# EAGLE design Adafruit 2.8 inch TFT w Capacitive Touch rev D (EAGLE 9.6.2)
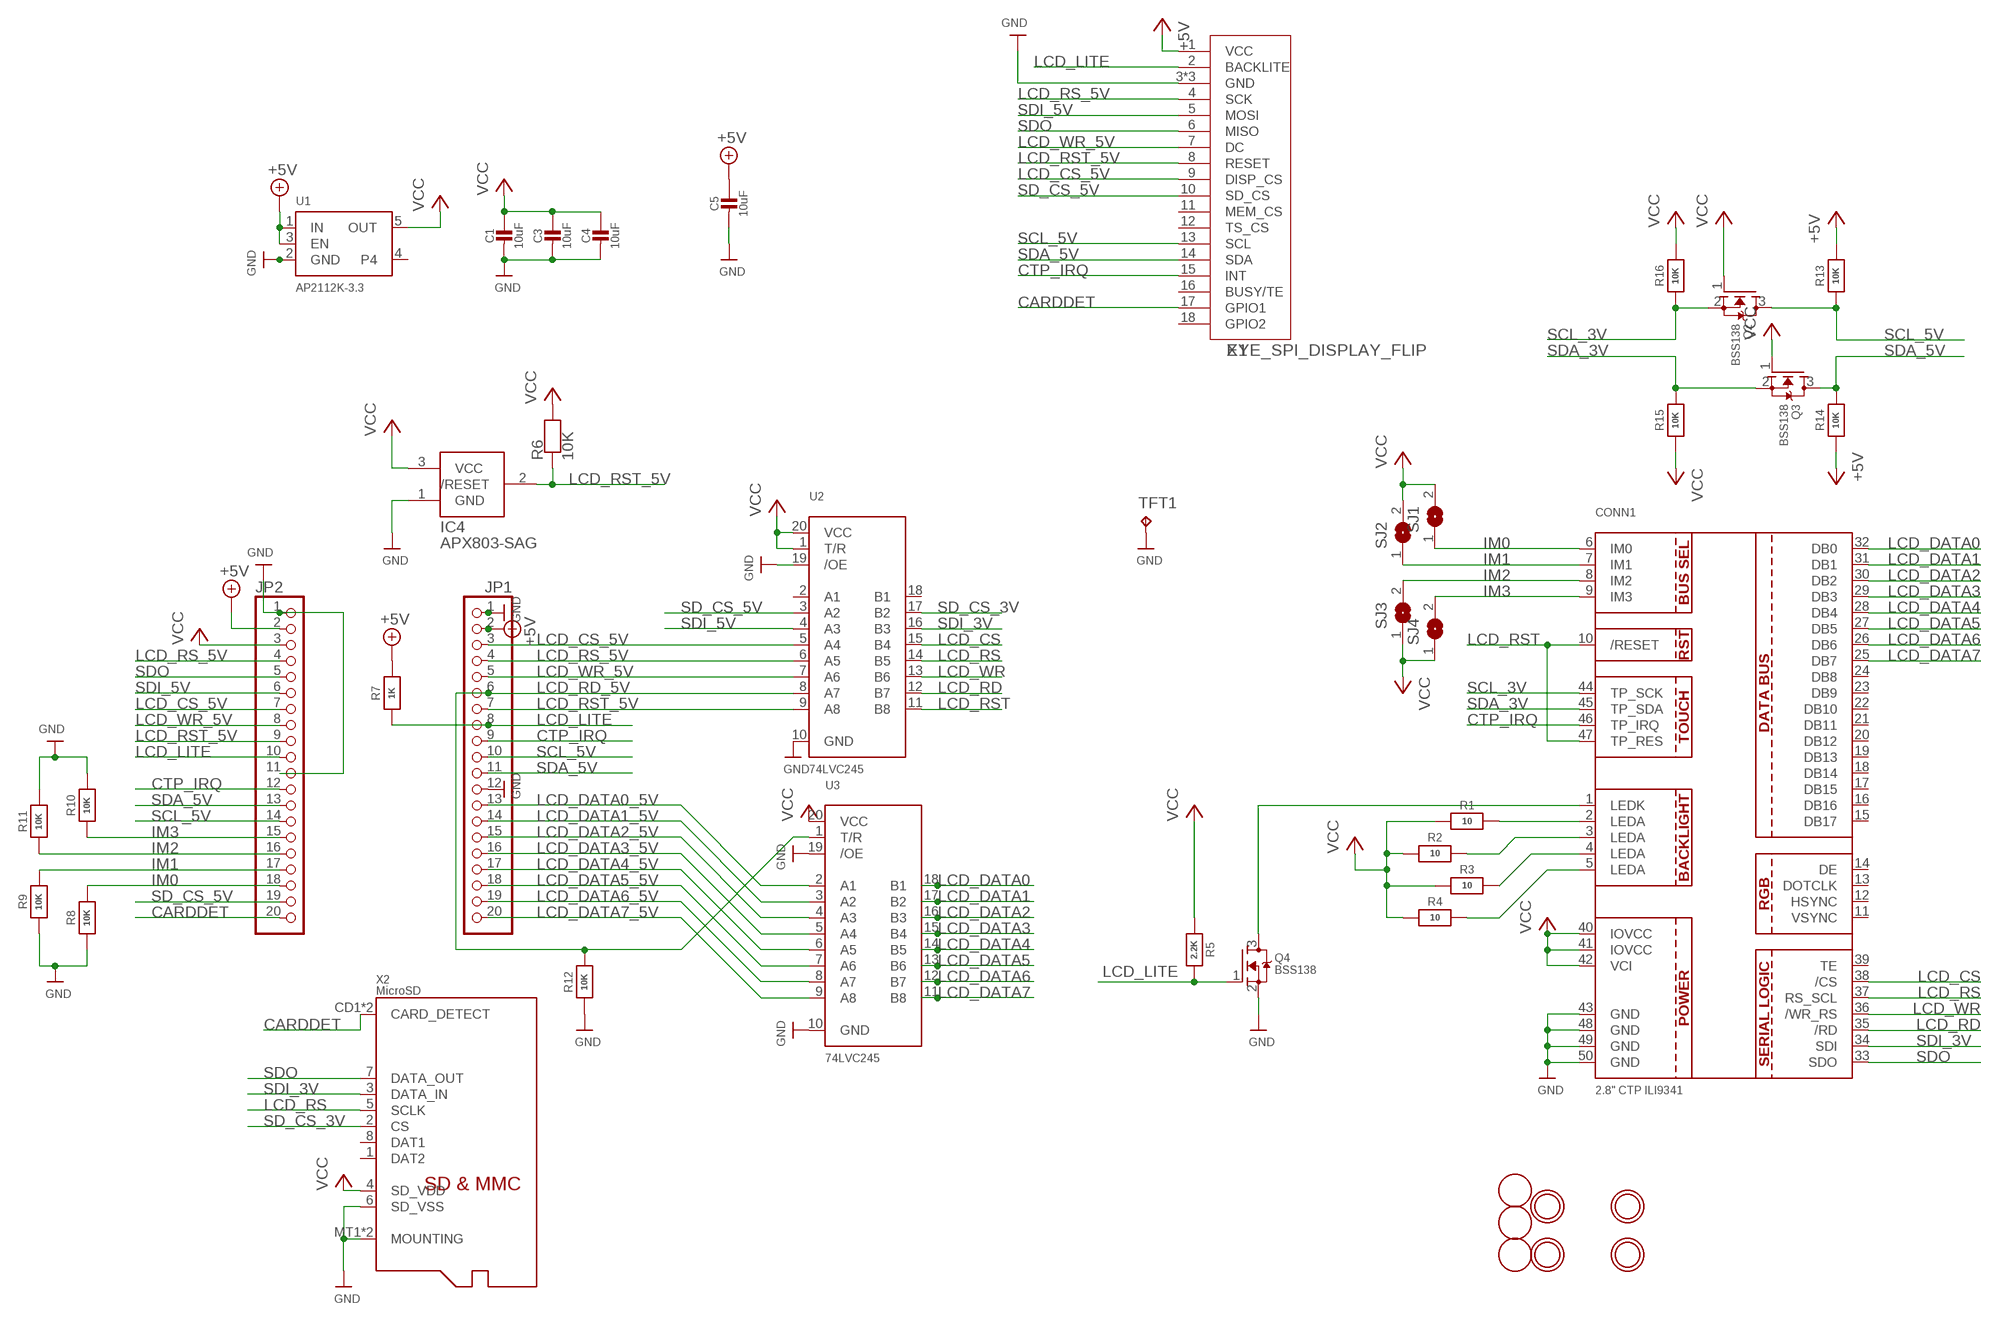
[diagram p0: schematic, sheet 1]

## Parts
C1  10uF  CAP_CERAMIC0805-NOOUTLINE  [0805-NO]
C3  10uF  CAP_CERAMIC0805-NOOUTLINE  [0805-NO]
C4  10uF  CAP_CERAMIC0805-NOOUTLINE  [0805-NO]
C5  10uF  CAP_CERAMIC0805-NOOUTLINE  [0805-NO]
CONN1  2.8" CTP ILI9341  DISP_LCD_CTP28_SAMPLE  [TFT_2.83IN_240X320_50PIN]
IC4  APX803-SAG  APX083-SAG  [SOT23-WIDE]
JP1  HEADER-1X20ROUND  [1X20_ROUND]
JP2  HEADER-1X20ROUND  [1X20_ROUND]
Q2  BSS138  MOSFET-NWIDE  [SOT23-WIDE]
Q3  BSS138  MOSFET-NWIDE  [SOT23-WIDE]
Q4  BSS138  MOSFET-NWIDE  [SOT23-WIDE]
R1  10  RESISTOR_0603_NOOUT  [0603-NO]
R2  10  RESISTOR_0603_NOOUT  [0603-NO]
R3  10  RESISTOR_0603_NOOUT  [0603-NO]
R4  10  RESISTOR_0603_NOOUT  [0603-NO]
R5  2.2K  RESISTOR_0603_NOOUT  [0603-NO]
R6  10K  RESISTOR_0603_NOOUT  [0603-NO]
R7  1K  RESISTOR_0603_NOOUT  [0603-NO]
R8  10K  RESISTOR_0603_NOOUT  [0603-NO]
R9  10K  RESISTOR_0603_NOOUT  [0603-NO]
R10  10K  RESISTOR_0603_NOOUT  [0603-NO]
R11  10K  RESISTOR_0603_NOOUT  [0603-NO]
R12  10K  RESISTOR_0603_NOOUT  [0603-NO]
R13  10K  RESISTOR_0603_NOOUT  [0603-NO]
R14  10K  RESISTOR_0603_NOOUT  [0603-NO]
R15  10K  RESISTOR_0603_NOOUT  [0603-NO]
R16  10K  RESISTOR_0603_NOOUT  [0603-NO]
SJ1  SOLDERJUMPER  [SOLDERJUMPER_ARROW_NOPASTE]
SJ2  SOLDERJUMPER  [SOLDERJUMPER_ARROW_NOPASTE]
SJ3  SOLDERJUMPER  [SOLDERJUMPER_ARROW_NOPASTE]
SJ4  SOLDERJUMPER  [SOLDERJUMPER_ARROW_NOPASTE]
TFT1  2.8in CTP TFT  TPTP06R  [TP06R]
U1  AP2112K-3.3  VREG_SOT23-5  [SOT23-5]
U2  74LVC245  74LCX245_TSSOP20  [TSSOP20]
U3  74LVC245  74LCX245_TSSOP20  [TSSOP20]
U$7  MOUNTINGHOLE3.0THIN  [MOUNTINGHOLE_3.0_PLATEDTHIN]
U$9  FIDUCIAL  [FIDUCIAL_1MM]
U$11  FIDUCIAL  [FIDUCIAL_1MM]
U$15  MOUNTINGHOLE3.0THIN  [MOUNTINGHOLE_3.0_PLATEDTHIN]
U$16  MOUNTINGHOLE3.0THIN  [MOUNTINGHOLE_3.0_PLATEDTHIN]
U$17  MOUNTINGHOLE3.0THIN  [MOUNTINGHOLE_3.0_PLATEDTHIN]
U$23  FIDUCIAL  [FIDUCIAL_1MM]
X1  EYE_SPI_DISPLAY_FLIP  [EYE_SPI_DISPLAY_BOTCONTACT]
X2  MicroSD  MICROSD  [MICROSD]

## Nets
+5V: C5.1 JP1.2 JP2.2 R7.2 R13.2 R14.1 U1.1(IN) U1.3(EN) X1.1(VCC)
CARDDET: JP2.20 X1.17(GPIO1) X2.CD1(CARD_DETECT) X2.CD2(CARD_DETECT)
CTP_IRQ: CONN1.46(TP_IRQ) JP1.9 JP2.12 X1.15(INT)
GND: C1.2 C3.2 C4.2 C5.2 CONN1.43(GND) CONN1.48(GND) CONN1.49(GND) CONN1.50(GND) IC4.1(GND) JP1.1 JP1.12 JP2.1 JP2.11 Q4.2(S) R8.1 R9.1 R10.2 R11.2 R12.1 TFT1.TP U1.2(GND) U2.10(GND) U2.19(/OE) U3.10(GND) U3.19(/OE) X1.3(GND) X1.SUPPORT1(GND) X1.SUPPORT2(GND) X2.6(SD_VSS) X2.MT1(MOUNTING) X2.MT2(MOUNTING)
IM0: CONN1.6(IM0) JP2.18 R8.2 SJ1.1
IM1: CONN1.7(IM1) JP2.17 R9.2 SJ2.1
IM2: CONN1.8(IM2) JP2.16 R11.1 SJ3.2
IM3: CONN1.9(IM3) JP2.15 R10.1 SJ4.2
LCD_CS: CONN1.38(/CS) U2.15(B4)
LCD_CS_5V: JP1.3 JP2.7 U2.5(A4) X1.9(DISP_CS)
LCD_DATA0: CONN1.32(DB0) U3.18(B1)
LCD_DATA0_5V: JP1.13 U3.2(A1)
LCD_DATA1: CONN1.31(DB1) U3.17(B2)
LCD_DATA1_5V: JP1.14 U3.3(A2)
LCD_DATA2: CONN1.30(DB2) U3.16(B3)
LCD_DATA2_5V: JP1.15 U3.4(A3)
LCD_DATA3: CONN1.29(DB3) U3.15(B4)
LCD_DATA3_5V: JP1.16 U3.5(A4)
LCD_DATA4: CONN1.28(DB4) U3.14(B5)
LCD_DATA4_5V: JP1.17 U3.6(A5)
LCD_DATA5: CONN1.27(DB5) U3.13(B6)
LCD_DATA5_5V: JP1.18 U3.7(A6)
LCD_DATA6: CONN1.26(DB6) U3.12(B7)
LCD_DATA6_5V: JP1.19 U3.8(A7)
LCD_DATA7: CONN1.25(DB7) U3.11(B8)
LCD_DATA7_5V: JP1.20 U3.9(A8)
LCD_LITE: JP1.8 JP2.10 Q4.1(G) R5.2 R7.1 X1.2(BACKLITE)
LCD_RD: CONN1.35(/RD) U2.12(B7)
LCD_RD_5V: JP1.6 R12.2 U2.8(A7) U3.1(T/R)
LCD_RS: CONN1.37(RS_SCL) U2.14(B5) X2.5(SCLK)
LCD_RS_5V: JP1.4 JP2.4 U2.6(A5) X1.4(SCK)
LCD_RST: CONN1.10(/RESET) CONN1.47(TP_RES) U2.11(B8)
LCD_RST_5V: IC4.2(/RESET) JP1.7 JP2.9 R6.1 U2.9(A8) X1.8(RESET)
LCD_WR: CONN1.36(/WR_RS) U2.13(B6)
LCD_WR_5V: JP1.5 JP2.8 U2.7(A6) X1.7(DC)
N$1: CONN1.5(LEDA) R4.2
N$2: CONN1.2(LEDA) R1.2
N$3: CONN1.3(LEDA) R2.2
N$4: CONN1.4(LEDA) R3.2
N$5: CONN1.1(LEDK) Q4.3(D)
SCL_3V: CONN1.44(TP_SCK) Q2.2(S) R16.1
SCL_5V: JP1.10 JP2.14 Q2.3(D) R13.1 X1.13(SCL)
SD_CS_3V: U2.17(B2) X2.2(CS)
SD_CS_5V: JP2.19 U2.3(A2) X1.10(SD_CS)
SDA_3V: CONN1.45(TP_SDA) Q3.2(S) R15.2
SDA_5V: JP1.11 JP2.13 Q3.3(D) R14.2 X1.14(SDA)
SDI_3V: CONN1.34(SDI) U2.16(B3) X2.3(DATA_IN)
SDI_5V: JP2.6 U2.4(A3) X1.5(MOSI)
SDO: CONN1.33(SDO) JP2.5 X1.6(MISO) X2.7(DATA_OUT)
VCC: C1.1 C3.1 C4.1 CONN1.40(IOVCC) CONN1.41(IOVCC) CONN1.42(VCI) IC4.3(VCC) JP2.3 Q2.1(G) Q3.1(G) R1.1 R2.1 R3.1 R4.1 R5.1 R6.2 R15.1 R16.2 SJ1.2 SJ2.2 SJ3.1 SJ4.1 U1.5(OUT) U2.1(T/R) U2.20(VCC) U3.20(VCC) X2.4(SD_VDD)
Unconnected: CONN1.11(VSYNC) CONN1.12(HSYNC) CONN1.13(DOTCLK) CONN1.14(DE) CONN1.15(DB17) CONN1.16(DB16) CONN1.17(DB15) CONN1.18(DB14) CONN1.19(DB13) CONN1.20(DB12) CONN1.21(DB11) CONN1.22(DB10) CONN1.23(DB9) CONN1.24(DB8) CONN1.39(TE) U1.4 U2.2(A1) U2.18(B1) X1.11(MEM_CS) X1.12(TS_CS) X1.16(BUSY/TE) X1.18(GPIO2) X2.1(DAT2) X2.8(DAT1)

## Library data of the parts
C1 C3-C5 = microbuilder:CAP_CERAMIC: Ceramic Capacitors For new designs, use the packages preceded by an '_' character since they are more reliable: The following footprints should be used on most boards: _0402 - Standard footprint for regular board layouts _0603 - Standard footprint for regular board layouts _0805 - Standard footprint for regular board layouts _1206 - Standard footprint for regular board layouts For extremely tight-pitch boards where space is at a premium, the following 'micro-pitch' footprints can be used (smaller pads, no silkscreen outline, etc.): _0402MP - Micro-pitch footprint for very dense/compact boards _0603MP - Micro-pitch footprint for very dense/compact boards _0805MP - Micro-pitch footprint for very dense/compact boards _1206MP - Micro-pitch footprint for very dense/compact boards
CONN1 = adafruit_display:DISP_LCD_CTP28: 2.83" 240x320 Pixel Capacitive Touch Display
IC4 = microbuilder:APX083
JP1 JP2 = microbuilder:HEADER-1X20
Q2-Q4 = microbuilder:MOSFET-N: N-Channel Mosfet LEGEND VDS: Voltage Drain-Source ID: Drain Current RDS(ON): Drain-Source On-State Resistance VGS(TH): Gate-Source Threshold Voltage CISS: Drain-Source Input Capacitance SOT-23 Name VDS ID RDS(ON) VGS(TH) CISS Order Number 2N7002E 60V 260mA 2.5 Ohm 2.5V @ 250uA 26.7pF @ 25V 2N7002ET1GOSTR-ND BSH103 30V 850mA 400 mOhm 400mV @ 1mA 83pF @ 24V BSH103,235-ND BSS138 60V 320mA 1.6 Ohm 1.5V @ 250uA 50pF @ 10V Mouser: 771-BSS138PW115 DMN2075U-7 20V 4.2A 38 mOhm 1V @ 250 uA 594.3pF @ 10V DMN2075U-7DICT-ND * BSS138 good choice for I2C level-shifting POWERPAK 1212-8 Name VDS ID RDS(ON) VGS(TH) CISS Order Number Si7308DN 60V 6A 58 mOhm 3V @ 250uA 665pF @ 15V SI7308DN-T1-E3CT-ND
R1-R16 = microbuilder:RESISTOR: Resistors For new designs, use the packages preceded by an '_' character since they are more reliable: The following footprints should be used on most boards: _0402 - Standard footprint for regular board layouts _0603 - Standard footprint for regular board layouts _0805 - Standard footprint for regular board layouts _1206 - Standard footprint for regular board layouts For extremely tight-pitch boards where space is at a premium, the following 'micro-pitch' footprints can be used (smaller pads, no silkscreen outline, etc.): _0402MP - Micro-pitch footprint for very dense/compact boards _0603MP - Micro-pitch footprint for very dense/compact boards _0805MP - Micro-pitch footprint for very dense/compact boards _1206MP - Micro-pitch footprint for very dense/compact boards
SJ1-SJ4 = microbuilder:SOLDERJUMPER: SMD Solder JUMPER Solder the two pads together to create a connection, or remove the solder to break it. REFLOW - Use this footprint for solder paste and reflow ovens. WAVE - Use this footprint for hand-soldering (larger pads). CLOSED - Has a trace between the two pads to ensure it is closed by default. The trace needs to be cut to disable the jumper, and can be closed again by creating a solder bridge between the two pads.; BOM: EXCLUDE
TFT1 = testpad:TP: Test pad
U1 = adafruit_power:VREG_SOT23-5: SOT23-5 Fixed Voltage Regulators Part Current Out V Out V In V Dropout θJA (°C/W) TJ (°C) Digikey Part No. ADP121 150mA 3.3V 3.4-5.5V 0.09V @ 150mA -- -- ADP121-AUJZ33R7CT-ND ADP121 150mA 3.0V 3.1-5.5V 0.09V @ 150mA -- -- ADP121-AUJZ30R7CT-ND ADP122 300mA 3.3V 3.4-5.5V 0.085V @ 300mA -- -- ADP122AUJZ-3.3-R7CT-ND ADP1712 300mA 3.3V 3.5-5.5V 0.17V @ 300mA -- -- ADP1712AUJZ-3.3-R7TR-ND AP7311 (Low Cost) 150mA 3.3V 3.5-6V 0.15V @ 150mA -- -- AP7311-33WG-7DICT-ND LD39015M18R 150mA 1.8V 1.9V-5.5V 0.08V @ 100mA -- -- 497-6977-1-ND LP2985A-33DBVR 150mA 3.3V 3.3-16V 0.28V @ 150mA 206 150 296-18479-1-ND MCP1824T-3302E/OT 300mA 3.3V 3.5V-6V 0.2V @ 300mA -- -- MCP1824T-3302E/OTCT-ND MIC5205-2.5YM5 TR 150mA 2.5V 2.7-16V 0.165V @ 150mA -- -- 576-1257-2-ND MIC5205-3.0YM5 TR 150mA 3.0V 3.2V-16V 0.165V @ 150mA -- -- 576-1258-2-ND MIC5205-3.3YM5 TR 150mA 3.3V 3.5V-16V 0.165V @ 150mA -- -- 576-1259-2-ND TPS780330220 150mA 3.3V+2.2V 3.6-5.5V 250mV Max -- -- 296-23332-1-ND TDA3663/N1,135 100mA 3.3V 3.5-45V 0.18V @ 50mA -- -- 568-5343-1-ND Max operating temp can be calculated using θJA, TJ (max junction temperature), and power in watts. Set the "Maximum Ambient Temperature" until it reaches TJ ("Max Junction Temperature"), which is the absolute limit for safe use of the regulator: Heat Sink Temperature Calculator <http://www.daycounter.com/Calculators/Heat-Sink-Temperature-Calculator.phtml> For example, With 12V source into a 3.3V LP2985 and a 30mA load, we are dissipating (12V-3.3V) * 0.03A = 0.261W. With a θJA of 206 °C/W, a TJ of 150°C, and 261mW we can safely use the chip without a heat sink up to 75°C (=147.1°C Junction Temperature).; JLC_ROTATION: 0
U2 U3 = microbuilder:74LCX245: 74LCX245MTC - 5.0V Tolerant Bi-Directional Buffer Can be used to interface 5.0V logic to 2.5 or 3.3V devices Digikey: 74LCX245MTCXTR-ND Mouser: 512-74LCX245MTCX
U$7 U$15-U$17 = adafruit_electromech:MOUNTINGHOLE: Mounting Hole For #2 screws (0.086"/2.18mm width, 0.094"/2.4mm hole) use 2.5mm; BOM: EXCLUDE
U$9 U$11 U$23 = adafruit:FIDUCIAL: For use by pick and place machines to calibrate the vision/machine, 1mm By microbuilder.eu
X1 = adafruit_display:EYE_SPI_DISPLAY; LCSC: C2856802
X2 = adafruit_electromech:MICROSD: MicroSD/Transflash Card Holder with SPI pinout 3M: 2908-05WB-MG 4UConnector: 19656 Footprint courtesy: Adafruit Industries; JLC_ROTATION: 90; LCSC: C125617

## Board
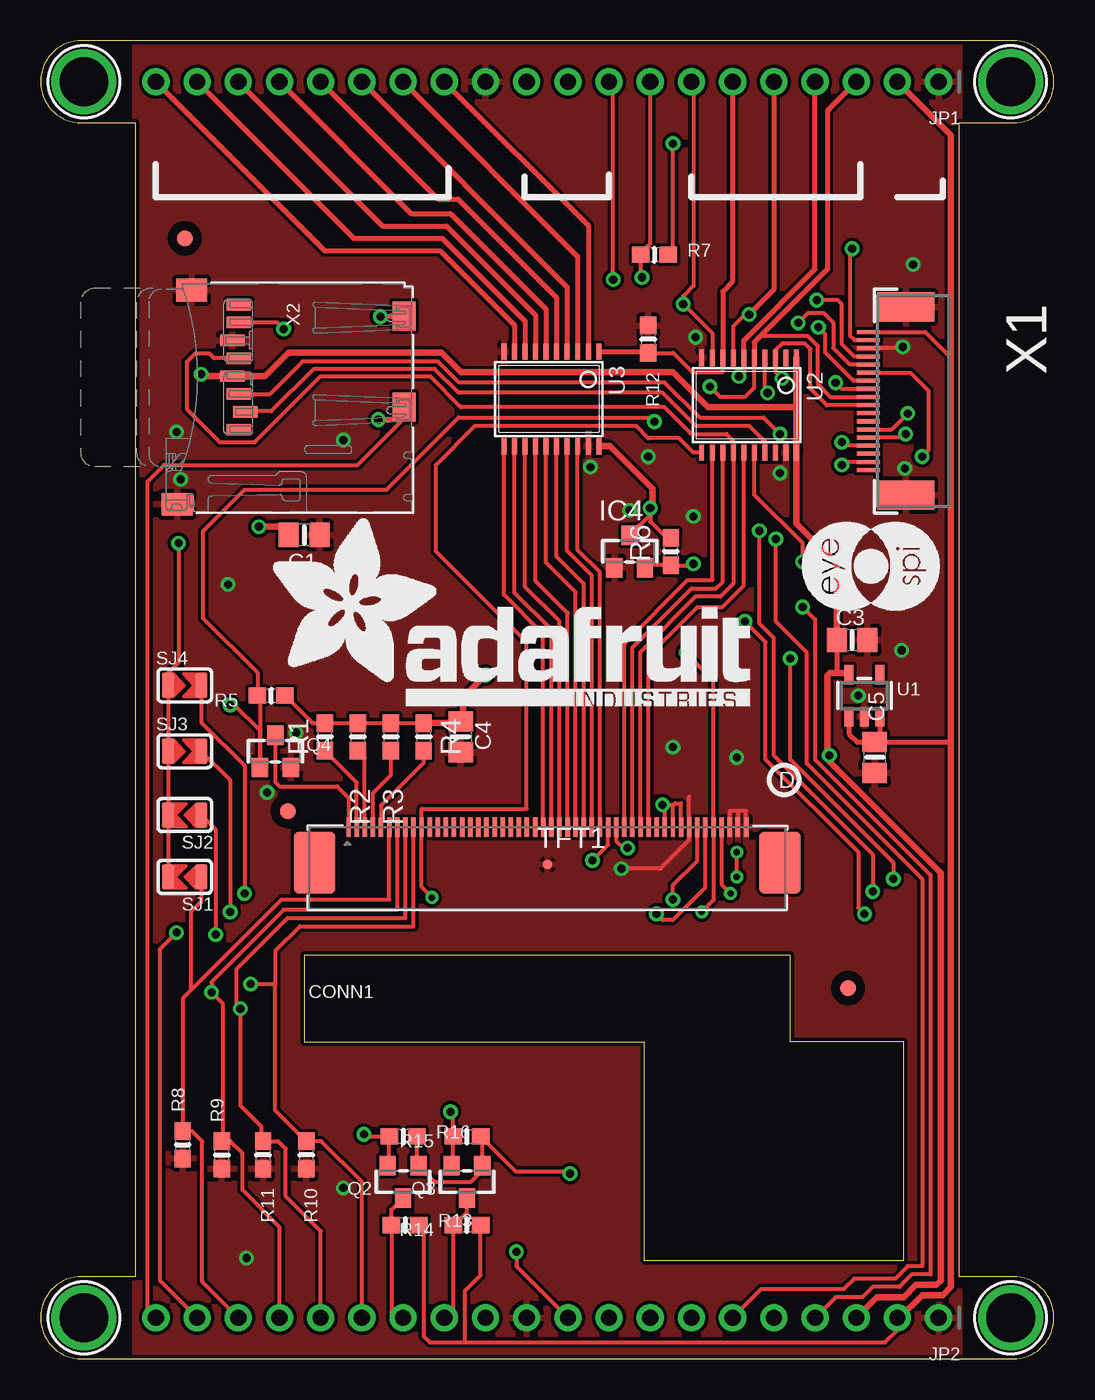
[diagram p1: board, top side]
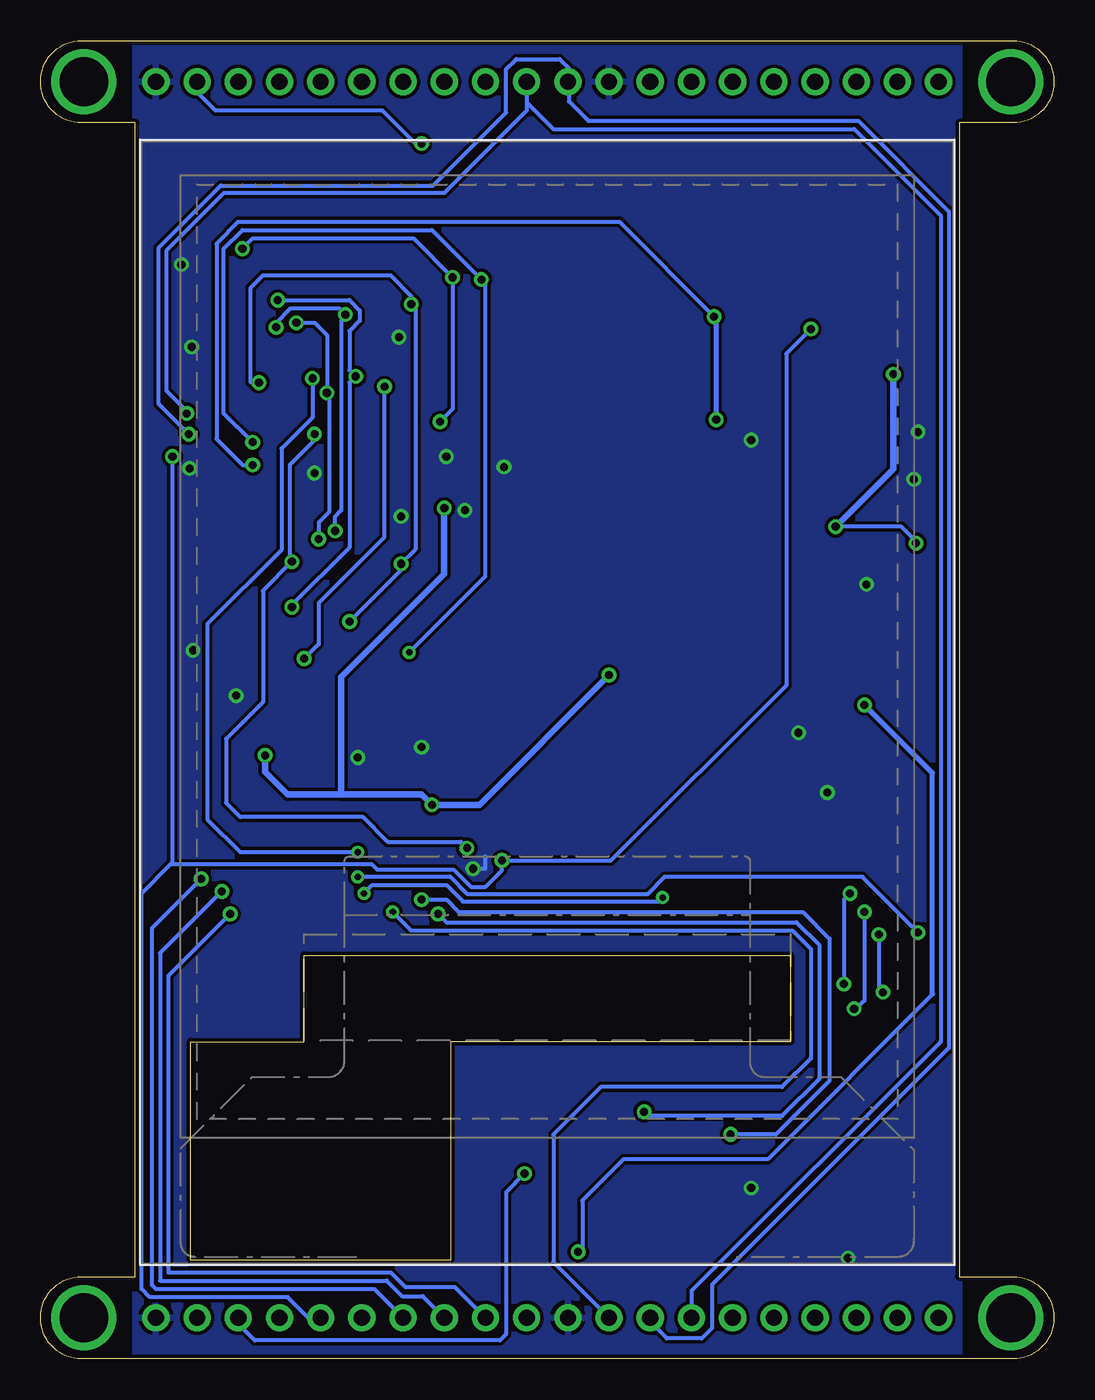
[diagram p2: board, bottom side, seen from below]

Size 62.48 x 81.28 mm. Coordinates in mm from the lower left corner, seen from the top.
Outline: 0,2.54 arc90 2.54,0 59.94,0 arc90 62.48,2.54 arc90 59.94,5.08 56.64,5.08 56.64,76.2 59.94,76.2 arc90 62.48,78.74 arc90 59.94,81.28 2.54,81.28 arc90 0,78.74 arc90 2.54,76.2 5.84,76.2 5.84,5.08 2.54,5.08 arc90 0,2.54
Outline: 16.26,24.89 16.26,19.56 37.21,19.56 37.21,6.1 53.21,6.1 53.21,19.56 46.23,19.56 46.23,24.89 16.26,24.89
Copper layers (1*16): Top 0.035mm / dielectric 1.5mm / Bottom 0.035mm
Design rules "adafruit *": minimum track width 8mil, minimum drill 15.5mil, track to track 8mil, track to pad 8mil, pad to pad 8mil, via to via 8mil, smd to smd 8mil, copper to edge 10mil, drill to drill 8mil, minimum pad ring 10mil, minimum via ring 8mil, stop-mask expansion 4mil, vias tented up to drill 20mil, thermal gap 10mil
tRestrict: area 42.7,32.6 to 42.8,32.9; area 43.2,32.6 to 43.3,32.9

### Footprints (pad centres in the part's own frame; a part is rotated, then mirrored left to right if it is on the bottom)
0805-NO = smd 1.24 x 1.5: 1 -0.95,0; 2 0.95,0
TFT_2.83IN_240X320_50PIN = smd 0.275 x 1.2 bottom: 1 12.25,1.04; 2 11.75,1.04; 3 11.25,1.04; 4 10.75,1.04; 5 10.25,1.04; 6 9.75,1.04; 7 9.25,1.04; 8 8.75,1.04; 9 8.25,1.04; 10 7.75,1.04; 11 7.25,1.04; 12 6.75,1.04; 13 6.25,1.04; 14 5.75,1.04; 15 5.25,1.04; 16 4.75,1.04; 17 4.25,1.04; 18 3.75,1.04; 19 3.25,1.04; 20 2.75,1.04; 21 2.25,1.04; 22 1.75,1.04; 23 1.25,1.04; 24 0.75,1.04; 25 0.25,1.04; 26 -0.25,1.04; 27 -0.75,1.04; 28 -1.25,1.04; 29 -1.75,1.04; 30 -2.25,1.04; 31 -2.75,1.04; 32 -3.25,1.04; 33 -3.75,1.04; 34 -4.25,1.04; 35 -4.75,1.04; 36 -5.25,1.04; 37 -5.75,1.04; 38 -6.25,1.04; 39 -6.75,1.04; 40 -7.25,1.04; 41 -7.75,1.04; 42 -8.25,1.04; 43 -8.75,1.04; 44 -9.25,1.04; 45 -9.75,1.04; 46 -10.25,1.04; 47 -10.75,1.04; 48 -11.25,1.04; 49 -11.75,1.04; 50 -12.25,1.04 | smd 2.54 x 3.81 bottom: PAD1 14.35,-1.152; PAD2 -14.35,-1.152
SOT23-WIDE = smd 1 x 1.2: 1 -0.95,-1; 2 0.95,-1; 3 0,1
1X20_ROUND = drill 1 pad 1.676: 1 -24.13,0; 2 -21.59,0; 3 -19.05,0; 4 -16.51,0; 5 -13.97,0; 6 -11.43,0; 7 -8.89,0; 8 -6.35,0; 9 -3.81,0; 10 -1.27,0; 11 1.27,0; 12 3.81,0; 13 6.35,0; 14 8.89,0; 15 11.43,0; 16 13.97,0; 17 16.51,0; 18 19.05,0; 19 21.59,0; 20 24.13,0
0603-NO = smd 1.075 x 1: 1 -0.85,0; 2 0.85,0
SOLDERJUMPER_ARROW_NOPASTE = smd 0.762 x 1.524: 1 -1.016,0; 2 1.016,0
TP06R = smd 0.6 x 0.6: TP 0,0
SOT23-5 = smd 0.55 x 1.2: 1 -0.95,-1.3; 2 0,-1.3; 3 0.95,-1.3; 4 0.95,1.3; 5 -0.95,1.3
TSSOP20 = smd 0.305 x 0.991: 1 -2.925,-2.918; 2 -2.275,-2.918; 3 -1.625,-2.918; 4 -0.975,-2.918; 5 -0.325,-2.918; 6 0.325,-2.918; 7 0.975,-2.918; 8 1.625,-2.918; 9 2.275,-2.918; 10 2.925,-2.918; 11 2.925,2.918; 12 2.275,2.918; 13 1.625,2.918; 14 0.975,2.918; 15 0.325,2.918; 16 -0.325,2.918; 17 -0.975,2.918; 18 -1.625,2.918; 19 -2.275,2.918; 20 -2.925,2.918
MOUNTINGHOLE_3.0_PLATEDTHIN = drill 3 pad 3.6: P$1 0,0
FIDUCIAL_1MM = smd 1 x 1: 1 0,0
EYE_SPI_DISPLAY_BOTCONTACT = smd 0.25 x 1.4: 1 4.25,1.154; 2 3.75,1.154; 3 3.25,1.154; 4 2.75,1.154; 5 2.25,1.154; 6 1.75,1.154; 7 1.25,1.154; 8 0.75,1.154; 9 0.25,1.154; 10 -0.25,1.154; 11 -0.75,1.154; 12 -1.25,1.154; 13 -1.75,1.154; 14 -2.25,1.154; 15 -2.75,1.154; 16 -3.25,1.154; 17 -3.75,1.154; 18 -4.25,1.154 | smd 1.8 x 3.5: SUPPORT1 -5.8,-1.152; SUPPORT2 5.8,-1.152
MICROSD = smd 0.7 x 1.5: 1 1.761,-3.147; 2 0.661,-2.747; 3 -0.439,-3.147; 4 -1.539,-3.547; 5 -2.639,-3.147; 6 -3.739,-3.547; 7 -4.839,-3.147; 8 -5.939,-3.147 | smd 1.8 x 1.4: CD1 -5.239,7.053; CD2 0.38,7.053 | smd 1.4 x 1.9: MT1 -6.839,-6.047; MT2 6.361,-6.947

### Placement (x,y rotation side)
C1  16.26,50.8 0 top
C3  50.04,44.32 0 top
C4  25.91,38.35 270 top
C5  51.44,37.08 270 top
CONN1  31.24,31.75 0 bottom
IC4  36.32,49.78 0 top
JP1  31.24,78.74 180 top
JP2  31.24,2.54 180 top
PLABEL0  [PLABEL0]  27.43,37.97 0 top
PLABEL1  [PLABEL1]  55.88,17.65 90 top
PLABEL2  [PLABEL2]  26.54,52.7 0 top
PLABEL3  [PLABEL3]  24.64,65.28 0 top
PLABEL4  [PLABEL4]  6.6,77.47 270 top
PLABEL5  [PLABEL5]  8.89,77.47 270 top
PLABEL6  [PLABEL6]  11.43,77.47 270 top
PLABEL7  [PLABEL7]  13.97,77.6 270 top
PLABEL8  [PLABEL8]  16.64,77.72 270 top
PLABEL9  [PLABEL9]  19.18,77.72 270 top
PLABEL10  [PLABEL10]  21.59,77.72 270 top
PLABEL11  [PLABEL11]  24.26,77.72 270 top
PLABEL12  [PLABEL12]  26.8,77.72 270 top
PLABEL13  [PLABEL13]  29.21,77.72 270 top
PLABEL14  [PLABEL14]  31.88,77.72 270 top
PLABEL15  [PLABEL15]  34.29,77.72 270 top
PLABEL16  [PLABEL16]  36.96,77.72 270 top
PLABEL17  [PLABEL17]  39.5,77.72 270 top
PLABEL18  [PLABEL18]  41.91,77.72 270 top
PLABEL19  [PLABEL19]  44.58,77.72 270 top
PLABEL20  [PLABEL20]  47.12,77.72 270 top
PLABEL21  [PLABEL21]  49.53,77.6 270 top
PLABEL22  [PLABEL22]  52.2,77.72 270 top
PLABEL23  [PLABEL23]  54.61,77.72 270 top
PLABEL24  [PLABEL24]  11.18,67.56 0 top
PLABEL25  [PLABEL25]  27.81,68.33 0 top
PLABEL26  [PLABEL26]  39.62,69.85 0 top
PLABEL27  [PLABEL27]  52.58,69.6 0 top
PLABEL28  [PLABEL28]  39.62,68.2 0 top
PLABEL29  [PLABEL29]  11.43,69.6 0 top
PLABEL30  [PLABEL30]  27.3,34.67 0 top
PLABEL31  [PLABEL31]  7.62,3.81 90 top
PLABEL32  [PLABEL32]  10.16,3.81 90 top
PLABEL33  [PLABEL33]  12.7,3.81 90 top
PLABEL34  [PLABEL34]  15.24,3.81 90 top
PLABEL35  [PLABEL35]  17.78,3.81 90 top
PLABEL36  [PLABEL36]  20.32,3.81 90 top
PLABEL37  [PLABEL37]  22.86,3.81 90 top
PLABEL38  [PLABEL38]  25.4,3.81 90 top
PLABEL39  [PLABEL39]  27.94,3.81 90 top
PLABEL40  [PLABEL40]  30.48,3.81 90 top
PLABEL41  [PLABEL41]  33.02,3.81 90 top
PLABEL42  [PLABEL42]  35.56,3.81 90 top
PLABEL43  [PLABEL43]  38.1,3.68 90 top
PLABEL44  [PLABEL44]  40.51,3.68 90 top
PLABEL45  [PLABEL45]  40.89,3.68 0 top
PLABEL46  [PLABEL46]  43.43,0.38 0 top
PLABEL47  [PLABEL47]  46.23,3.68 0 top
PLABEL48  [PLABEL48]  50.8,3.43 90 top
PLABEL49  [PLABEL49]  53.34,3.56 90 top
PLABEL50  [PLABEL50]  56.01,3.56 90 top
PLABEL51  [PLABEL51]  7.75,30.99 0 top
PLABEL52  [PLABEL52]  7.87,34.8 0 top
PLABEL53  [PLABEL53]  7.75,38.73 0 top
PLABEL54  [PLABEL54]  7.75,42.8 0 top
PLABEL55  [PLABEL55]  28.58,14.86 0 top
PLABEL56  [PLABEL56]  13.84,28.96 90 top
PLABEL57  [PLABEL57]  9.65,77.47 0 bottom
PLABEL58  [PLABEL58]  12.19,77.47 0 bottom
PLABEL59  [PLABEL59]  14.73,77.47 0 bottom
PLABEL60  [PLABEL60]  17.27,77.47 0 bottom
PLABEL61  [PLABEL61]  7.11,77.47 0 bottom
PLABEL62  [PLABEL62]  19.81,77.47 0 bottom
PLABEL63  [PLABEL63]  22.35,77.47 0 bottom
PLABEL64  [PLABEL64]  24.89,77.47 0 bottom
PLABEL65  [PLABEL65]  27.3,81.03 0 bottom
PLABEL66  [PLABEL66]  29.97,77.47 0 bottom
PLABEL67  [PLABEL67]  32.64,81.03 0 bottom
PLABEL68  [PLABEL68]  35.05,77.47 0 bottom
PLABEL69  [PLABEL69]  37.59,81.15 0 bottom
PLABEL70  [PLABEL70]  40.13,77.47 0 bottom
PLABEL71  [PLABEL71]  42.8,79.88 180 bottom
PLABEL72  [PLABEL72]  45.21,77.47 0 bottom
PLABEL73  [PLABEL73]  47.62,79.76 180 bottom
PLABEL74  [PLABEL74]  50.29,77.47 0 bottom
PLABEL75  [PLABEL75]  52.83,81.15 0 bottom
PLABEL76  [PLABEL76]  55.37,77.6 0 bottom
PLABEL77  [PLABEL77]  7.11,5.08 0 bottom
PLABEL78  [PLABEL78]  9.65,0.25 0 bottom
PLABEL79  [PLABEL79]  12.19,3.68 0 bottom
PLABEL80  [PLABEL80]  14.73,0.25 0 bottom
PLABEL81  [PLABEL81]  17.27,3.68 0 bottom
PLABEL82  [PLABEL82]  19.81,0.25 0 bottom
PLABEL83  [PLABEL83]  22.35,3.68 0 bottom
PLABEL84  [PLABEL84]  24.89,0.25 0 bottom
PLABEL85  [PLABEL85]  27.43,3.68 0 bottom
PLABEL86  [PLABEL86]  29.97,0.25 0 bottom
PLABEL87  [PLABEL87]  32.51,3.68 0 bottom
PLABEL88  [PLABEL88]  35.05,0.25 0 bottom
PLABEL89  [PLABEL89]  37.59,3.56 0 bottom
PLABEL90  [PLABEL90]  40.26,0.25 0 bottom
PLABEL91  [PLABEL91]  42.67,3.68 0 bottom
PLABEL92  [PLABEL92]  45.09,0.25 0 bottom
PLABEL93  [PLABEL93]  47.75,3.68 0 bottom
PLABEL94  [PLABEL94]  50.29,0.25 0 bottom
PLABEL95  [PLABEL95]  52.83,3.56 0 bottom
PLABEL96  [PLABEL96]  55.37,0.25 0 bottom
Q2  22.35,10.92 180 top
Q3  26.29,10.92 180 top
Q4  14.48,37.47 0 top
R1  17.53,38.35 270 top
R2  19.56,38.35 270 top
R3  21.59,38.35 270 top
R4  23.62,38.35 270 top
R5  14.22,40.89 180 top
R6  38.86,49.78 90 top
R7  37.85,68.07 0 top
R8  8.76,13.21 90 top
R9  11.18,12.57 90 top
R10  16.38,12.57 270 top
R11  13.72,12.57 270 top
R12  37.47,62.87 270 top
R13  22.48,8.26 0 top
R14  26.29,8.26 180 top
R15  26.29,13.72 180 top
R16  22.35,13.72 0 top
SJ1  8.89,29.72 180 top
SJ2  8.89,33.53 180 top
SJ3  8.89,37.47 0 top
SJ4  8.89,41.53 0 top
TFT1  31.24,30.48 0 top
U1  50.8,40.89 0 top
U2  43.69,58.8 180 top
U3  31.5,59.18 180 top
U$7  2.67,2.54 0 top
U$9  49.78,22.86 0 top
U$11  8.89,69.09 0 top
U$15  59.82,2.54 0 top
U$16  2.67,78.74 0 top
U$17  59.82,78.74 0 top
U$19  [ADAFRUIT_TEXT_30MM]  14.1,40.26 0 top
U$23  15.24,33.78 0 top
U$28  [PCBFEAT-REV-040]  45.85,35.69 0 top
U$29  [EYESPI_MINI_LOGO]  55.5,46.1 90 top
X1  52.2,59.05 90 top
X2  15.37,59.05 270 top

### Tracks (layer width: path | path; a pad name or v marks a point on that pad's centre or on a via)
+5V  (via drill 0.5)
  Top 0.254: R7.2 38.99,68.07 v38.99,74.93 | R13.2 23.62,7.96 23.62,1.4 24,1.02 26.04,1.02 | 26.04,1.02 26.16,1.14 26.16,4.19 27.14,5.17 R14.1 | 26.04,1.02 52.07,1.02 52.83,1.78 JP2.2 | X1.1 54.55,63.3 56.13,61.72
  Top 0.305: U1.1 49.85,38.54 50.36,38.03 C5.1 | U1.3 51.75,38.35 C5.1 | C5.1 55.95,38.03 56.13,37.85
  Top 0.406: JP1.2 56.13,75.44 56.13,61.72 56.13,37.85 56.13,4.45 55.63,3.94 54.36,3.94 52.96,2.54 JP2.2
  Bottom 0.254: v38.99,74.93 39.37,74.93 41.4,76.96 51.69,76.96 52.83,78.11 JP1.2
CARDDET  (via drill 0.5)
  Top 0.254: JP2.20 6.6,3.05 6.6,54.1 7.62,55.12 19.56,55.12 22.42,57.98 | X1.17 49.59,55.3 v49.4,55.12
  Top 0.305: 22.42,57.98 X2.CD2 22.42,58.23 22.1,57.91 v20.83,57.91 | v20.95,64.26 20.99,64.29 X2.CD1
  Bottom 0.254: v20.95,64.26 26.8,70.1 50.29,70.1 51.64,68.76 51.64,56.72 50.04,55.12 v49.4,55.12
  Bottom 0.305: v20.95,64.26 20.83,64.14 v20.83,57.91
CTP_IRQ  (via drill 0.39, 0.5)
  Top 0.254: v40.77,27.56 41.49,28.28 CONN1.46 41.49,41.81 41.51,41.81 v39.75,43.56 | v35.31,66.55 35.31,78.49 JP1.9 | X1.15 49.61,56.3 v49.4,56.52
  Bottom 0.254: v39.75,43.56 35.05,48.26 35.05,66.29 v35.31,66.55 38.35,69.6 50.04,69.6 51.18,68.45 51.18,58.29 v49.4,56.52 | v40.77,27.56 39.62,26.42 16.13,26.42 14.99,25.27 14.99,18.54 16.76,16.76 27.94,16.76 30.86,13.84 30.86,5.97 JP2.12
GND  (via drill 0.5)
  Top 0.254: 39.99,34.66 CONN1.43 39.99,31.99 38.23,30.23 v35.81,30.23 | CONN1.48 42.49,33.78 42.99,33.78 | 42.99,33.78 CONN1.49 | v53.16,62.39 53.07,62.3 X1.3 | CONN1.50 43.49,33.78 42.99,33.78
  Bottom 0.254: v35.81,30.23 35.05,30.23 35.05,30.99
  other vias: 36.32,52.32 45.59,54.61 38.99,37.72 42.93,37.08 50.42,40.89 53.09,43.69 13.97,34.92 8.38,57.15 18.67,10.54 12.7,6.22 15.75,38.61 40.39,62.99 33.91,54.99 18.67,56.64 40.26,51.94 37.47,55.63 8.64,54.23 11.56,47.75 53.8,67.47 53.29,54.9
  pour Top: 5.84,81.28 5.84,0 56.64,0 56.64,81.28
  pour Bottom: 5.84,81.28 5.84,-0.25 56.64,-0.25 56.64,81.28
IM0
  Top 0.254: 9.27,22.73 14.86,28.32 21.49,28.32 CONN1.6 | JP2.18 9.97,4.77 9.97,13.4 9.31,14.06 R8.2 8.76,22.23 9.27,22.73 | SJ1.1 9.91,28.19 9.27,27.56 9.27,22.73
IM1  (via drill 0.5)
  Top 0.254: CONN1.7 21.99,27.69 14.99,27.69 10.54,23.24 v10.54,22.61 11.23,21.92 11.23,13.47 R9.2 11.7,13.42 12.45,12.68 12.45,10.41 14.73,8.13 JP2.17 | SJ2.1 10.8,32.64 v10.8,26.16
  Bottom 0.254: v10.8,26.16 10.8,22.86 v10.54,22.61
IM2  (via drill 0.5)
  Top 0.254: CONN1.8 22.49,27.18 15.24,27.18 12.07,24 12.07,21.84 v12.32,21.59 12.32,15.62 13.59,14.35 13.59,13.9 13.72,13.78 R11.1 14.64,13.42 15.11,12.95 15.11,10.03 17.27,7.87 JP2.16 | SJ3.2 11.68,35.69 v11.68,27.56
  Bottom 0.254: v11.68,27.56 11.68,22.1 12.19,21.59 v12.32,21.59
IM3  (via drill 0.5)
  Top 0.254: CONN1.9 22.99,26.67 16,26.67 14.48,25.15 14.48,23.11 | JP2.15 19.81,10.92 17.31,13.42 R10.1 14.48,15.33 14.48,23.11 | SJ4.2 9.91,39.24 12.57,36.58 v12.57,28.7 | v12.95,23.11 14.48,23.11
  Bottom 0.254: v12.57,28.7 12.95,28.32 v12.95,23.11
LCD_CS
  Top 0.254: CONN1.38 37.49,43.33 40.51,46.36 42.04,46.36 43.36,47.68 U2.15
LCD_CS_5V  (via drill 0.5)
  Top 0.254: v46.23,43.18 46.23,36.96 52.58,30.61 v52.58,29.59 | v41.27,59.94 41.91,59.31 43.43,59.31 44.01,59.89 U2.5 | X1.9 48.71,59.3 47.93,60.09 47.93,60.2 47.93,62.43 47.31,63.06 44.64,63.06 44.51,63.18
  Top 0.305: U2.5 44.01,62.68 44.51,63.18 48.51,67.18 48.51,76.96 JP1.3
  Bottom 0.254: v46.23,43.18 45.34,44.07 45.34,46.61 41.27,50.67 v41.27,59.94 | v52.58,29.59 55.63,26.54 55.63,4.57 55.37,4.32 41.91,4.32 JP2.7
LCD_DATA0
  Top 0.254: CONN1.32 34.49,48.51 33.12,49.88 U3.18
LCD_DATA0_5V
  Top 0.305: U3.2 33.77,69.86 JP1.13
LCD_DATA1
  Top 0.254: CONN1.31 33.99,48.3 32.47,49.83 U3.17
LCD_DATA1_5V
  Top 0.305: JP1.14 33.12,67.97 U3.3
LCD_DATA2
  Top 0.254: CONN1.30 33.49,47.79 31.82,49.46 U3.16
LCD_DATA2_5V
  Top 0.305: JP1.15 32.47,66.08 U3.4
LCD_DATA3
  Top 0.254: CONN1.29 32.99,47.27 31.17,49.09 U3.15
LCD_DATA3_5V
  Top 0.305: U3.5 31.82,65.42 25.74,71.5 24.51,71.5 JP1.16
LCD_DATA4
  Top 0.254: CONN1.28 32.49,45.99 30.52,47.97 U3.14
LCD_DATA4_5V
  Top 0.305: JP1.17 22.86,70.61 25.27,70.61 31.17,64.71 U3.6
LCD_DATA5
  Top 0.254: CONN1.27 31.99,45.48 29.87,47.6 U3.13
LCD_DATA5_5V
  Top 0.305: JP1.18 21.08,69.85 25.02,69.85 30.52,64.35 U3.7
LCD_DATA6
  Top 0.254: CONN1.26 31.49,44.96 29.22,47.23 U3.12
LCD_DATA6_5V
  Top 0.305: JP1.19 19.3,69.09 24.77,69.09 29.87,63.98 U3.8
LCD_DATA7
  Top 0.254: CONN1.25 30.99,44.7 28.57,47.12 U3.11
LCD_DATA7_5V
  Top 0.305: JP1.20 17.53,68.33 24.64,68.33 29.22,63.74 U3.9
LCD_LITE  (via drill 0.5)
  Top 0.254: v37.85,57.78 37.59,58.04 25.79,58.04 21.34,53.59 12.57,53.59 10.03,51.05 10.03,45.66 13.37,42.32 R5.2 13.53,40.74 Q4.1 13.53,38.73 11.94,40.32 v11.68,40.32 | JP1.8 37.59,68.8 37,68.2 R7.1 37,66.76 v37.08,66.67 | v29.34,6.6 29.34,5.72 JP2.10 | X1.2 50.19,62.8 49.91,63.09 49.91,68.33 v50.04,68.45
  Bottom 0.254: 7.49,22.48 17.65,12.32 26.54,12.32 29.08,9.78 29.08,6.86 v29.34,6.6 | v37.85,57.78 37.08,58.55 v37.08,66.67 39.5,69.09 49.4,69.09 v50.04,68.45
  Bottom 0.305: 7.49,22.48 | 7.49,22.48 7.49,36.13 v11.68,40.32
LCD_RD
  Top 0.254: CONN1.35 35.99,44.12 39.88,48.01 41.4,48.01 41.41,48.02 U2.12
LCD_RD_5V
  Top 0.254: R12.2 39.02,62.02 40.2,60.83 42.04,60.83 42.06,60.86 U2.8
  Top 0.305: JP1.6 42.67,66.42 42.06,65.81 U2.8 | R12.2 37.37,62.1 U3.1
LCD_RS
  Top 0.254: CONN1.37 36.99,43.6 40.39,46.99 41.91,46.99 42.71,47.79 U2.14 42.71,56.6 42.29,57.02 40.13,57.02 38.48,58.67 25.91,58.67 24,60.58 17.27,60.58 13.21,56.52 11.05,56.52 9.02,58.55 9.02,61.47 9.53,61.98 10.41,61.98 10.7,61.69 X2.5
LCD_RS_5V  (via drill 0.5)
  Top 0.254: v46.99,46.36 47.75,45.59 47.75,36.96 54.86,29.84 54.86,5.21 53.72,5.21 52.96,4.45 51.31,4.45 50.67,3.81 49.02,3.81 JP2.4 | X1.4 50.16,61.8 49.4,62.57 49.4,65.02 49.15,65.28 v47.86,65.28
  Top 0.305: JP1.4 47.75,67.18 43.36,62.79 U2.6 43.36,60.81 43.13,60.58 v43.05,60.58
  Bottom 0.254: v46.99,46.36 46.99,46.48 43.43,50.04 43.43,60.2 v43.05,60.58 43.43,60.96 43.43,63.37 42.8,64.01 42.8,64.64 43.43,65.28 v47.86,65.28
LCD_RST  (via drill 0.39)
  Top 0.254: CONN1.47 41.99,29.26 v42.55,28.7 | v24.13,28.45 23.49,29.09 CONN1.10 23.49,33.91 29.97,33.91 29.97,44.2 24.38,49.78 24.38,55.12 26.8,57.53 36.7,57.53 37.47,56.77 39.37,56.77 40.26,55.88 U2.11
  Bottom 0.254: v42.55,28.7 42.04,29.21 37.47,29.21 36.45,28.19 24.38,28.19 v24.13,28.45
LCD_RST_5V  (via drill 0.5)
  Top 0.254: v43.43,45.47 44.7,44.2 44.7,36.96 50.42,31.24 50.42,27.81 v50.8,27.43 | U2.9 41.41,63.23 v39.62,65.02 39.62,65.53 40.26,66.17 40.26,78.61 JP1.7 | v40.26,49.02 40.13,48.9 38.9,48.9 R6.1 37.34,48.93 37.38,48.89 IC4.2 | X1.8 49.41,59.8 v49.02,60.2
  Bottom 0.254: v43.43,45.47 40.26,48.64 v40.26,49.02 39.37,49.91 39.37,64.77 v39.62,65.02 39.62,65.53 40.89,66.8 48.77,66.8 49.53,66.04 49.53,60.2 v49.02,60.2 | v50.8,27.43 54.61,23.62 54.61,5.33 40.89,5.33 40.01,4.45 36.96,4.45 JP2.9
LCD_WR
  Top 0.254: CONN1.36 36.49,43.86 40.13,47.5 41.66,47.5 42.06,47.91 U2.13
LCD_WR_5V  (via drill 0.5)
  Top 0.254: v44.32,51.05 44.32,45.34 45.21,44.45 45.21,37.21 51.31,31.12 v51.31,28.83 | U2.7 42.71,63.67 43.43,64.39 v43.69,64.39 | X1.7 50.13,60.3 48.39,62.05 48.39,63.18 v47.96,63.61
  Top 0.305: JP1.5 45.21,65.91 v43.69,64.39
  Bottom 0.254: v44.32,51.05 44.32,51.94 43.94,52.32 43.94,64.01 43.69,64.26 v43.69,64.39 44.07,64.77 47.05,64.77 47.96,63.86 v47.96,63.61 | v51.31,28.83 55.12,25.02 55.12,4.83 41.15,4.83 40.2,3.87 38.93,3.87 JP2.8
N$1
  Top 0.254: R4.2 23.62,36.74 20.99,34.11 CONN1.5
N$2
  Top 0.254: CONN1.2 19.49,35.54 R1.2
N$3
  Top 0.254: CONN1.3 19.99,37.07 R2.2
N$4
  Top 0.254: R3.2 21.59,35.98 20.49,34.88 CONN1.4
N$5
  Top 0.254: Q4.3 14.48,35.56 14.73,35.31 18.29,35.31 19,34.59 CONN1.1
SCL_3V  (via drill 0.5)
  Top 0.254: Q2.2 21.5,12.02 R16.1 20.07,13.72 v19.94,13.84 | v38.99,28.32 38.99,29.21 40.49,30.71 CONN1.44
  Bottom 0.254: v38.99,28.32 37.47,28.32 36.7,27.56 15.49,27.56 13.84,25.91 13.84,17.14 17.15,13.84 v19.94,13.84
SCL_5V  (via drill 0.5)
  Top 0.254: JP2.14 21.97,2.54 21.63,2.88 R13.1 21.63,9.2 Q2.3 | v53.47,58.29 52.48,57.3 X1.13
  Bottom 0.254: JP2.14 22.35,4.19 6.98,19.56 6.98,70.48 12.32,75.82 30.86,75.82 32.51,77.47 JP1.10 32.51,76.96 37.59,71.88 51.18,71.88 54.74,68.33 54.74,59.69 53.47,58.42 v53.47,58.29
SD_CS_3V
  Top 0.254: X2.2 12.65,58.42 14.22,58.42 16.84,61.04 24.31,61.04 25.78,59.56 38.35,59.56 40.39,57.53 43.69,57.53 44.66,56.56 U2.17
SD_CS_5V  (via drill 0.39, 0.5)
  Top 0.254: JP2.19 7.37,4.83 7.37,25.27 v8.38,26.29 | v42.93,29.72 v42.93,31.24 | v45.72,60.45 45.31,60.86 U2.3 45.31,62.18 45.73,62.6 47.12,62.6 47.47,62.24 47.47,59.81 48.48,58.8 X1.10
  Bottom 0.254: v45.72,60.45 45.72,58.04 47.62,56.13 47.62,49.88 52.2,45.3 52.2,33.27 50.16,31.24 v42.93,31.24 | v8.38,26.29 11.81,29.72 24,29.72 25.07,28.65 36.14,28.65 37.21,29.72 v42.93,29.72
SDA_3V  (via drill 0.5)
  Top 0.254: Q3.2 25.44,12.02 R15.2 25.44,15.07 v25.27,15.24 | CONN1.45 40.99,29.05 38.99,27.05 38.35,27.05 v37.97,27.43
  Bottom 0.254: v37.97,27.43 37.47,26.92 15.88,26.92 14.48,25.53 14.48,17.27 16.76,14.99 25.53,14.99 v25.27,15.24
SDA_5V  (via drill 0.5)
  Top 0.254: Q3.3 26.29,9.03 25.51,8.26 R14.2 25.44,3.09 JP2.13 | v53.34,57.02 53.12,56.8 X1.14
  Bottom 0.254: JP1.11 29.91,78.68 | JP2.13 24.89,2.29 23.88,1.27 21.72,1.27 21.08,1.91 21.08,4.57 6.48,19.18 6.48,70.74 12.07,76.33 28.7,76.33 29.91,77.53 29.91,78.68 | v53.34,57.02 55.19,58.88 55.19,68.52 51.37,72.34 38.28,72.34 33.78,76.84 33.78,79.5 33.15,80.14 30.48,80.14 29.91,79.56 29.91,78.68
SDI_3V  (via drill 0.5)
  Top 0.254: CONN1.34 35.49,31.95 35.94,31.5 v36.2,31.5 | X2.3 14.16,59.49 16.15,61.49 24.5,61.49 25.79,60.2 38.48,60.2 40.64,58.04 44.58,58.04 v45.59,57.02 | U2.16 44.01,53.27 46.99,50.29 v46.99,49.15
  Bottom 0.254: v45.59,57.02 45.59,56.64 47.12,55.12 47.12,49.28 v46.99,49.15 48.77,47.37 48.77,40.51 51.05,38.23 51.05,34.29 50.16,33.4 42.6,33.4 41.07,31.88 36.58,31.88 v36.2,31.5
SDI_5V  (via drill 0.5)
  Top 0.254: JP2.6 44.45,4.32 49.53,4.32 50.16,4.95 52.7,4.95 53.47,5.72 54.36,5.72 54.36,29.59 47.24,36.7 47.24,43.56 45.34,45.47 v45.34,50.55 | U2.4 44.66,59.56 v44.83,59.56 | X1.5 49.9,61.3 48.87,62.33 48.87,63.88 48.26,64.5 47.33,64.5 v46.72,63.88
  Bottom 0.254: v45.34,50.55 45.34,51.56 44.7,52.2 44.7,59.44 v44.83,59.56 44.83,63.12 45.59,63.88 v46.72,63.88
SDO  (via drill 0.5)
  Top 0.254: v34.04,30.73 34.99,31.69 CONN1.33 | v14.99,63.5 14.59,63.89 X2.7 | v54.36,55.63 54.74,56.01 54.74,59.69 53.62,60.8 X1.6
  Bottom 0.254: v14.99,63.5 16.51,61.98 16.51,41.53 27.3,30.73 v34.04,30.73 34.04,30.12 35.05,29.11 35.95,29.11 37.02,30.18 41.73,30.18 42.04,30.48 54.48,30.48 | JP2.5 45.97,2.54 47.24,3.81 55.75,3.81 56.26,4.32 56.26,28.7 54.48,30.48 | 54.48,30.48 54.36,30.61 v54.36,55.63
VCC  (via drill 0.5)
  Top 0.254: R4.1 R3.1 R2.1 R1.1 16.76,39.2 R5.1 | R6.2 38.58,50.63 37.59,51.62 v37.59,52.45 37.59,52.05 IC4.3 | SJ1.2 SJ2.2 SJ3.1 SJ4.1 7.87,42.29 8.51,42.93 v8.51,50.29 | R16.2 23.2,12.02 Q2.1 24.3,10.92 26.54,10.92 27.24,11.62 Q3.1 27.24,13.62 R15.1 29.3,11.56 32.51,11.56 v32.64,11.43 | CONN1.40 38.49,34.16 v38.35,34.16 38.95,34.16 38.99,34.12 | CONN1.42 39.49,34.25 39.12,34.25 38.99,34.12 | CONN1.41 38.99,34.12
  Top 0.305: C3.1 49.09,42.29 | 49.85,42.29 U1.5
  Top 0.406: C3.1 49.09,49.02 46.61,51.5 U2.20 46.61,58.67 | JP2.3 51.56,3.81 53.21,3.81 53.98,4.57 55.25,4.57 55.5,4.83 55.5,29.97 48.64,36.83 v48.64,37.21 48.51,37.34 48.51,42.13 48.68,42.29 49.09,42.29 49.85,42.29 | R4.1 25.81,39.2 C4.1 25.91,39.24 26.04,39.12 26.04,40.77 v27.43,42.16 | v37.59,52.45 37.72,52.58 37.72,53.65 35.1,56.26 U3.20 | C1.1 14.8,51.31 v13.46,51.31 | v9.91,60.71 10.02,60.59 X2.4 13.86,60.59 15.29,62.03 24.72,62.03 25.91,60.83 38.99,60.83 41.15,58.67 46.61,58.67 | U2.1 46.61,58.67
  Bottom 0.254: v8.51,50.29 8.45,50.36 9.4,51.31 v13.46,51.31 | v32.64,11.43 33.78,10.29 33.78,1.52 34.16,1.14 49.28,1.14 50.29,2.16 JP2.3
  Bottom 0.406: 43.94,34.8 47.24,34.8 48.64,36.2 v48.64,37.21 | 43.94,34.8 43.94,42.04 37.59,48.39 v37.59,52.45 | v13.46,51.31 9.91,54.86 v9.91,60.71 | 43.94,34.8 38.99,34.8 v38.35,34.16 35.43,34.16 v27.43,42.16

### Text on the board
Pinguin_tBackup: D7 | D6 | D5 | D4 | D3 | D2 | D1 | D0 | GND | SDA | SCL | IRQ | Backlite | RST | RD | WR | C/D | CS | 3-5V | GND | LCD Data I/O | LCD control | PWR | Capacitive / Touchscreen | Inputs | Bi-directional | 8-bit 8080-type parallel | Logic:3V-5V | IM3 | IM2 | 2.8" TFT ILI9341 | I2C CapTouch | IM1 | IM0 | Close IM1/IM2/IM3 / for SPI | SPI Interface | Vin:3.3V-5V | MISO | Card Detect | Card CS | IM0 | IM1 | IM2 | IM3 | SCL | SDA | IRQ | GND | Lite | RST | DC | CS | 3Vo | Vin | GND | MOSI | CLK
Pinguin_bBackup: GND | SCL | Lite | RD | C/D | Vin | D7 | D6 | D5 | D4 | D3 | D2 | D1 | D0 | SDA | IRQ | RST | WR | CS | GND | CD | IM0 | IM2 | SCL | IRQ | Lite | D/C | MOSI | CLK | Vin | CCS | IM1 | IM3 | SDA | GND | RST | CS | MISO | 3Vo | GND